# Altium schematic sheet PowerBoard_Rev2.SchDoc
size A4
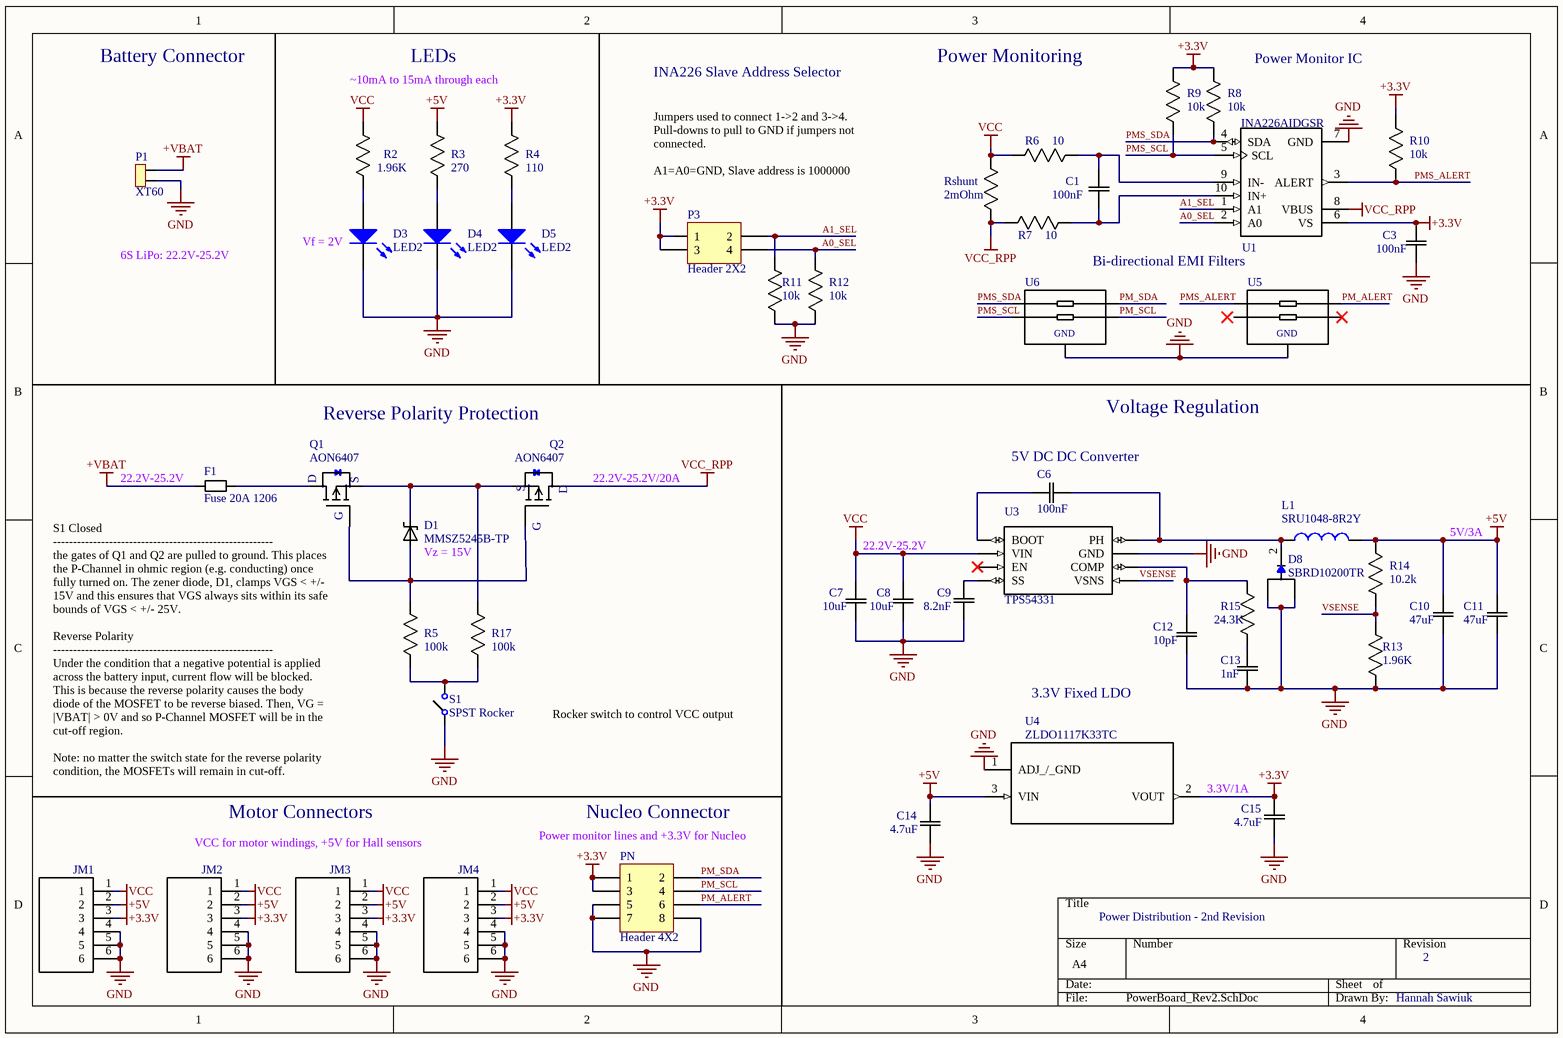
[diagram p0: PowerBoard_Rev2.SchDoc]

## Parts
C1  100nF  [0805]
C3  100nF  [0805]
C6  100nF  [0805]
C7  10uF  [1210]
C8  10uF  [1210]
C9  8.2nF  [0805]
C10  47uF  [1210]
C11  47uF  [1210]
C12  10pF  [0603]
C13  1nF  [0805]
C14  4.7uF  [0805]
C15  4.7uF  [0805]
D1  MMSZ5245B-TP  [SOD-123]
D3  LED2  [3.2X1.6X1.1]
D4  LED2  [3.2X1.6X1.1]
D5  LED2  [3.2X1.6X1.1]
D8  SBRD10200TR  [DPAK]
F1  Fuse 20A 1206  [1206]
JM1  CONN HEADER VERT 6POS 3.96MM  [CN HDR 6POS 3.96MM]  (value not drawn)
JM2  CONN HEADER VERT 6POS 3.96MM  [CN HDR 6POS 3.96MM]  (value not drawn)
JM3  CONN HEADER VERT 6POS 3.96MM  [CN HDR 6POS 3.96MM]  (value not drawn)
JM4  CONN HEADER VERT 6POS 3.96MM  [CN HDR 6POS 3.96MM]  (value not drawn)
L1  SRU1048-8R2Y  [Inductor]
P1  XT60  [XT60Connector]
P3  Header 2X2  [HDR2X2]
PN  Header 4X2  [HDR2X4]
Q1  AON6407  [8-PowerSMD]
Q2  AON6407  [8-PowerSMD]
R2  1.96K  [0805]
R3  270  [0805]
R4  110  [0805]
R5  100k  [0805]
R6  10  [0805]
R7  10  [0805]
R8  10k  [0805]
R9  10k  [0805]
R10  10k  [0805]
R11  10k  [0805]
R12  10k  [0805]
R13  1.96K  [0805]
R14  10.2k  [0805]
R15  24.3K  [0805]
R17  100k  [0805]
Rshunt  2mOhm  [1206]
S1  SPST Rocker  [SWITCH ROCKER SPST 10A 125V]
U1  INA226AIDGSR  [10-VSSOP]
U3  TPS54331  [8-PowerSOIC]
U4  ZLDO1117K33TC  [TO-252-3]
U5  EMI  [SOT-665]  (value not drawn)
U6  EMI  [SOT-665]  (value not drawn)

## Nets
+3.3V: C3.2(C2) C15.2(C2) JM1.3 JM2.3 JM3.3 JM4.3 P3.1 P3.3 PN.1 PN.3 R4.1(R1) R8.1(R1) R9.1(R1) R10.1(R1) U1.6(VS) U4.2(VOUT)
+5V: C10.2(C2) C11.2(C2) C14.2(C2) JM1.2 JM2.2 JM3.2 JM4.2 L1.2 R3.1(R1) R14.1(R1) U4.3(VIN)
+VBAT: F1.1 P1.2
GND: C3.1(C1) C7.1(C1) C8.1(C1) C9.2(C2) C10.1(C1) C11.1(C1) C12.1(C1) C13.1(C1) C14.1(C1) C15.1(C1) D3.2(K) D4.2(K) D5.2(K) D8.1 D8.3 JM1.4 JM1.5 JM1.6 JM2.4 JM2.5 JM2.6 JM3.4 JM3.5 JM3.6 JM4.4 JM4.5 JM4.6 P1.1 PN.5 PN.7 PN.8 R11.2(R2) R12.2(R2) R13.2(R2) S1.0 U1.7(GND) U3.7(GND) U4.1(ADJ_/_GND) U5.2(P$2) U6.2(P$2)
VCC: C7.2(C2) C8.2(C2) JM1.1 JM2.1 JM3.1 JM4.1 R2.1(R1) R6.2(R2) Rshunt.1(R1) U3.2(VIN)
VCC_RPP: Q2.D R7.2(R2) Rshunt.2(R2) U1.8(VBUS)
A0_SEL: P3.4 R12.1(R1) U1.2(A0)
A1_SEL: P3.2 R11.1(R1) U1.1(A1)
PM_ALERT: PN.6 U5.5(P$5)
PM_SCL: PN.4 U6.4(P$4)
PM_SDA: PN.2 U6.5(P$5)
PMS_ALERT: R10.2(R2) U1.3(ALERT) U5.1(P$1)
PMS_SCL: R9.2(R2) U1.5(SCL) U6.3(P$3)
PMS_SDA: R8.2(R2) U1.4(SDA) U6.1(P$1)
VSENSE: R13.1(R1) R14.2(R2) U3.5(VSNS)
NetC1_1: C1.1(C1) R7.1(R1) U1.10(IN+)
NetC1_2: C1.2(C2) R6.1(R1) U1.9(IN-)
NetC6_1: C6.1(C1) U3.1(BOOT)
NetC6_2: C6.2(C2) D8.2 L1.1 U3.8(PH)
NetC9_1: C9.1(C1) U3.4(SS)
NetC12_2: C12.2(C2) R15.1(R1) U3.6(COMP)
NetC13_2: C13.2(C2) R15.2(R2)
NetD1_A: D1.A Q1.G Q2.G R5.1(R1)
NetD1_C: D1.C Q1.S Q2.S R17.1(R1)
NetD3_1: D3.1(A) R2.2(R2)
NetD4_1: D4.1(A) R3.2(R2)
NetD5_1: D5.1(A) R4.2(R2)
NetF1_2: F1.2 Q1.D
NetR5_2: R5.2(R2) R17.2(R2) S1.1

Not connected (* = marked no-connect by the designer): U3 3(EN)* 9(PowerPAD); U5 3(P$3) 4(P$4)*

## Notes on the sheet
- Battery Connector
- ~10mA to 15mA through each
- LEDs
- INA226 Slave Address Selector
- Power Monitoring
- Power Monitor IC
- Jumpers used to connect 1->2 and 3->4. Pull-downs to pull to GND if jumpers not connected.
  A1=A0=GND, Slave address is 1000000
- (near D3) Vf = 2V
- 6S LiPo: 22.2V-25.2V
- Bi-directional EMI Filters
- Reverse Polarity Protection
- Voltage Regulation
- (near F1) 22.2V-25.2V
- (near Q2) 22.2V-25.2V/20A
- (near C6) 5V DC DC Converter
- (near D1) Vz = 15V
- 22.2V-25.2V
- 5V/3A
- Rocker switch to control VCC output
- 3.3V Fixed LDO
- (near Q1) S1 Closed
  -------------------------------------------------------
  the gates of Q1 and Q2 are pulled to ground. This places the P-Channel in ohmic region (e.g. conducting) once fully turned on. The zener diode, D1, clamps VGS < +/- 15V and this ensures that VGS always sits within its safe bounds of VGS < +/- 25V.
  Reverse Polarity
  -------------------------------------------------------
  Under the condition that a negative potential is applied across the battery input, current flow will be blocked. This is because the reverse polarity causes the body diode of the MOSFET to be reverse biased. Then, VG = |VBAT| > 0V and so P-Channel MOSFET will be in the cut-off region.
  Note: no matter the switch state for the reverse polarity condition, the MOSFETs will remain in cut-off.
- 3.3V/1A
- VCC for motor windings, +5V for Hall sensors
- Motor Connectors
- (near PN) Power monitor lines and +3.3V for Nucleo
- Nucleo Connector
- Power Distribution - 2nd Revision
- 2
- Hannah Sawiuk
- (in symbol IP4256CZ5-W) GND

## Library data of the parts
C1 C3 C6 = CAP 100nF 0805: CAP CER 0.1UF 50V X7R 0805; MP: CC0805KRX7R9BB104; MF: Yageo; Tolerance: 10%; Package: 0805; Price: 0,119 CAD; Value: 100nF; Digikey: 311-1140-1-ND; Digikey Link: https://www.digikey.ca/products/en?keywords=311-1140-1-ND; Rating: 50V
C7 C8 = CAP 10uF 1210: CAP CER 10UF 50V X7R 1210; MP: CL32B106KBJNNWE; MF: Samsung Electro-Mechanics; Tolerance: 10%; Package: 1210; Price: 0.95 CAD; Value: 10uF; Digikey: 1276-3388-1-ND; Digikey Link: https://www.digikey.ca/product-detail/en/samsung-electro-mechanics/CL32B106KBJNNWE/1276-3388-1-ND/3891474; Rating: 50V; ComponentLink1Description: digikey; ComponentLink1URL: https://www.digikey.ca/en/products/detail/kemet/C1210C106M5RACTU/4918883
C9 = CAP 8.2nF 0805: CAP CER 8200PF 50V X7R 0805; MP: C0805C822K5RACTU; MF: KEMET; Tolerance: 10%; Package: 0805; Price: 0,17 CAD; Value: 8.2nF; Digikey: 399-9275-1-ND; Digikey Link: https://www.digikey.ca/product-detail/en/kemet/C0805C822K5RACTU/399-9275-1-ND/3522793; Rating: 50V
C10 C11 = CAP 47uF 1210: CAP CER 47UF 6.3V X7R 1210; MP: GCM32ER70J476KE19L; MF: Murata Electronics; Tolerance: 10%; Package: 1210; Price: 1.68 CAD; Value: 47uF; Digikey: 490-4844-1-ND; Digikey Link: https://www.digikey.ca/product-detail/en/murata-electronics/GCM32ER70J476KE19L/490-4844-1-ND/1763982; Rating: 6.3V; ComponentLink1Description: digikey; ComponentLink1URL: https://www.digikey.ca/en/products/detail/kemet/C1210C106M5RACTU/4918883
C12 = CAP 10pF 0603: CAP CER SMD 0603 10PF 10% X7R 50; MP: C0603C100K5RAC7867; MF: KEMET; Rating: 50V; Package: 0603; Price: 0.4 CAD; Value: 10pF; Digikey: 399-17562-1-ND; Digikey Link: https://www.digikey.ca/product-detail/en/kemet/C0603C100K5RAC7867/399-17562-1-ND/8572562; Tolerance: 10%; ComponentLink1Description: digikey; ComponentLink1URL: https://www.digikey.ca/en/products/detail/kemet/C0603C100K5RAC7867/8572397
C13 = CAP 1nF 0805: CAP CER 1000PF 50V X7R 0805; MP: CC0805KRX7R9BB102; MF: Yageo; Tolerance: 10%; Package: 0805; Price: 0.1 CAD; Value: 1nF; Digikey: 311-1127-1-ND; Digikey Link: https://www.digikey.ca/products/en?keywords=311-1127-1-ND; Rating: 50V
C14 C15 = CAP 4.7uF 0805: CAP CER 4.7UF 25V X5R 0805; MP: CL21B475KOFNNNE; MF: Samsung Electro-Mechanics; Tolerance: 10%; Rating: 16V; Temperature Coefficient: X7R; Package: 0805; Price: 0,49 CAD; Value: 4.7uF; Digikey: 1276-2873-1-ND; Digikey Link: https://www.digikey.ca/product-detail/en/samsung-electro-mechanics/CL21B475KOFNNNE/1276-2873-1-ND/3890959
D1 = MMSZ5245B-TP: Zener Diode 15V 500mW ±5% Surface Mount SOD-123; MP: MMSZ5224BT1G; MF: ON Semiconductor; Price: None; SnapEDA_Link: https://www.snapeda.com/parts/MMSZ5224BT1G/ON%20Semiconductor/view-part/230941/?ref=snap; Package: SOD-123 ON Semiconductor; Availability: Unavailable; Value: *; ComponentLink1Description: digikey; ComponentLink1URL: https://www.digikey.ca/en/products/detail/micro-commercial-co/MMSZ5245B-TP/1793206
D3-D5 = LED GREEN SMD: Typical RED, GREEN, YELLOW, AMBER GaAs LED; MF: Lite-On Inc.; MP: LTST-C191KGKT; Rating: 2V; Digikey: 160-1446-1-ND; Digikey Link: https://www.digikey.ca/products/en?keywords=160-1446-1-ND; Package: 0603
D8 = SBRD10200TR: Diode Schottky 200V 10A Surface Mount DPAK; MF: SMC Diode; MP: SBRD10200TR; SnapEDA_Link: https://www.snapeda.com/parts/SBRD10200TR/SMC%20Diode%20Solutions/view-part/702246/?ref=snap; Package: TO-252-3 SMC; ComponentLink1Description: digikey; ComponentLink1URL: https://www.digikey.ca/product-detail/en/smc-diode-solutions/SBRD10200TR/1655-1939-1-ND/8625508; Digikey: 1655-1939-1-ND; Digikey Link: https://www.digikey.ca/product-detail/en/smc-diode-solutions/SBRD10200TR/1655-1939-1-ND/8625508
F1 = Fuse 20A 1206: FUSE BOARD MOUNT 20A 32VAC 63VDC; MF: Schurter Inc.; MP: 3413.0331.22; Digikey: 486-1689-6-ND; Rating: 20A; Digikey Link: https://www.digikey.ca/product-detail/en/schurter-inc/3413.0331.22/486-1689-6-ND/2870024
JM1-JM4 = CONN HEADER VERT 6POS 3.96MM: Connector Header Through Hole 6 position 0.156" (3.96mm); MF: TE Connectivity; MP: 1877285-6; Current Rating: 7.5A; Voltage Rating: 250VAC; SnapEDA_Link: https://www.snapeda.com/parts/1877285-6/TE%20Connectivity/view-part/2371244/?ref=snap; Digikey: https://www.digikey.ca/product-detail/en/te-connectivity-amp-connectors/1877285-6/A99849-ND/2000097; Digikey Link: A99849-ND
L1 = SRU1048-8R2Y: FIXED IND 8.2UH 4.6A 15 MOHM SMD; MF: Bourns Inc.; MP: SRU1048-8R2Y; Price: None; Package: Nonstandard; Value: 8.2uH; ComponentLink1Description: digikey; ComponentLink1URL: https://www.digikey.ca/en/products/detail/bourns-inc/SRU1048-8R2Y/2352912; Digikey: SRU1048-8R2YCT-ND; Digikey Link: https://www.digikey.ca/en/products/detail/bourns-inc/SRU1048-8R2Y/2352912
P1 = XT60 Connector: XT60 CONNECTORS FEMALE PAIR; MF: SparkFun Electronics; MP: PRT-10474; Digikey: 1568-1816-ND; Digikey Link: https://www.digikey.ca/product-detail/en/sparkfun-electronics/PRT-10474/1568-1816-ND/8258064; Package: XT60; Price: 2.13000 CAD; Value: N/A
P3 = Header 2X2: Header, 2-Pin, Dual row; LatestRevisionDate: 17-Jul-2002; LatestRevisionNote: Re-released for DXP Platform.; Publisher: Altium Limited
PN = Header 4X2: Header, 4-Pin, Dual row; LatestRevisionDate: 17-Jul-2002; LatestRevisionNote: Re-released for DXP Platform.; Publisher: Altium Limited
Q1 Q2 = AON6407: P-Channel 30V 32A (Ta), 85A (Tc) 7.3W (Ta), 83W (Tc) Surface Mount 8-DFN (5x6); MF: Alpha & Omega Semiconductor Inc.; Package: 8-PowerSMD; MP: AON6407; Digikey: 785-1421-1-ND; Digikey Link: https://www.digikey.ca/product-detail/en/alpha-omega-semiconductor-inc/AON6407/785-1421-1-ND/3466800
R2 R13 = RES 1.96k 0805: RES SMD 1.96K OHM 1% 1/8W 0805; MP: ERJ-6ENF1961V; MF: Panasonic Electronic Components; Rating: 0.125W; Digikey: P1.96KCCT-ND; Price: 0.15 CAD; Package: 0805; Value: 1.96k; Digikey Link: https://www.digikey.ca/product-detail/en/panasonic-electronic-components/ERJ-6ENF1961V/P1.96KCCT-ND/119041; Tolerance: 1%
R3 = RES 270 0805: RES SMD 270 OHM 5% 1/8W 0805; MP: RC0805JR-07270RL; MF: Yageo; Rating: 0.125W; Digikey: 311-270ARCT-ND; Price: 0.054 CAD; Package: 0805; Value: 270; Digikey Link: https://www.digikey.ca/product-detail/en/yageo/RC0805JR-07270RL/311-270ARCT-ND/731238
R4 = RES 110 0805: RES SMD 110 OHM 1% 1/8W 0805; MP: RC0805FR-07110RL; MF: Yageo; Rating: 0.125W; Digikey: 311-110CRCT-ND; Price: 0.15 CAD; Package: 0805; Value: 110; Digikey Link: https://www.digikey.ca/product-detail/en/yageo/RC0805FR-07110RL/311-110CRCT-ND/730506; Tolerance: 1%
R5 R17 = RES 100k 0805: RES SMD 100K OHM 1% 1/8W 0805; MP: RC0805FR-07100KL; MF: Yageo; Rating: 0.125W; Digikey: 311-100KCRCT-ND; Price: 0.058 CAD; Package: 0805; Value: 100k; Digikey Link: https://www.digikey.ca/products/en?keywords=311-100KCRCT-ND; Tolerance: 1%
R6 R7 = RES 10 0805: RES SMD 10 OHM 1% 1/8W 0805; MP: RC0805FR-0710RL; MF: Yageo; Rating: 0.125W; Digikey: 311-10.0CRCT-ND; Price: 0.15 CAD; Package: 0805; Value: 10; Digikey Link: https://www.digikey.ca/product-detail/en/yageo/RC0805FR-0710RL/311-10.0CRCT-ND/730481; Tolerance: 1%
R8-R12 = RES 10k 0805: RES SMD 10K OHM 1% 1/8W 0805; MP: RC0805FR-0710KL; MF: Yageo; Rating: 0.125W; Digikey: 311-10.0KCRCT-ND; Price: 0.061 CAD; Package: 0805; Value: 10k; Digikey Link: https://www.digikey.ca/products/en?keywords=311-10.0KCRCT-ND; Tolerance: 1%
R14 = RES 10.2k 0805: RES SMD 10.2K OHM 1% 1/8W 0805; MP: ERJ-6ENF1022V; MF: Panasonic Electronic Components; Rating: 0.125W; Digikey: P10.2KCCT-ND; Price: 0.15 CAD; Package: 0805; Value: 10.2k; Digikey Link: https://www.digikey.ca/product-detail/en/panasonic-electronic-components/ERJ-6ENF1022V/P10.2KCCT-ND/119251; Tolerance: 1%; ComponentLink1Description: digikey; ComponentLink1URL: https://www.digikey.ca/en/products/detail/panasonic-electronic-components/ERJ-6ENF1022V/111476
R15 = RES 24.3k 0805: RES SMD 24.3K OHM 1% 1/8W 0805; MP: RC0805FR-0724K3L; MF: Yageo; Rating: 0.125W; Digikey: 311-24.3KCRCT-ND; Price: 0.15 CAD; Package: 0805; Value: 24.3k; Digikey Link: https://www.digikey.ca/product-detail/en/yageo/RC0805FR-0724K3L/311-24.3KCRCT-ND/730705; Tolerance: 1%
Rshunt = RES 2mOhm 1206: RES 0.002 OHM 1% 1W 1206; MP: CSR1206-0R002F1; MF: Riedon; Value: 0.002; Rating: 0.125W; Digikey: 696-1370-1-ND; Price: 0.88 CAD; Package: 1206; Digikey Link: https://www.digikey.ca/product-detail/en/riedon/CSR1206-0R002F1/696-1370-1-ND/2813303
S1 = SWITCH ROCKER SPST 10A 125V: Rocker Switch SPST 10A (AC) 125V Panel Mount, Snap-In; MP: SRB22A2FBBNN; MF: ZF Electronics; Digikey: CH755-ND; Digikey Link: https://www.digikey.ca/product-detail/en/zf-electronics/SRB22A2FBBNN/CH755-ND/446021; Price: 1.276 CAD; Rating: 10A 125V
U1 = INA226AIDGSR: 36-V, Bi-Directional, Ultra-High Accuracy, Low-/High-Side, I2C Out Current/Power Monitor w/ Alert 10-VSSOP -40 to 125; MF: Texas Instruments; Price: None; MP: INA226AIDGSR; SnapEDA_Link: https://www.snapeda.com/parts/INA226AIDGSR/Texas%20Instruments/view-part/53552/?ref=snap; Package: MSOP-10 Texas Instruments; Availability: Unavailable; Value: *; Digikey: 296-29034-2-ND; Digikey Link: https://www.digikey.ca/product-detail/en/texas-instruments/INA226AIDGSR/296-29034-2-ND/2687236
U3 = TPS54331: Buck Switching Regulator IC Positive Adjustable 0.8V 1 Output 3A 8-SOIC _0.154, 3.90mm Width_; MP: TPS54331DDAR; MF: Texas Instruments; SnapEDA_Link: https://www.snapeda.com/parts/TPS54331/Texas%20Instruments/view-part/568919/?ref=snap; Package: 8-PowerSOIC; Digikey: 296-39419-1-ND; Digikey Link: https://www.digikey.ca/product-detail/en/texas-instruments/TPS54331DDAR/296-39419-1-ND/5143369
U4 = ZLDO1117K33TC: Linear Voltage Regulator IC Positive Fixed 1 Output  1A TO-252-3; MF: Diodes Incorporated; Package: TO-252-3; MP: ZLDO1117K33TC; Digikey: ZLDO1117K33DIDKR-ND; Digikey Link: https://www.digikey.ca/product-detail/en/diodes-incorporated/ZLDO1117K33TC/ZLDO1117K33DIDKR-ND/2095639
U5 U6 = IP4256CZ5-W: RC (Pi) EMI Filter 2nd Order Low Pass 2 Channel R = 100Ohms, C = 19pF (Total)  SOT-665; MF: Nexperia USA Inc.; MP: IP4256CZ5-W,115; SnapEDA_Link: https://www.snapeda.com/parts/IP4256CZ5-W/Nexperia%20USA%20Inc./view-part/3605439/?ref=snap; Price: 0.17 CAD; Package: SOT-665; Digikey: 1727-4718-1-ND; Digikey Link: https://www.digikey.ca/product-detail/en/nexperia-usa-inc/IP4256CZ5-W115/1727-4718-1-ND/2531158